# EAGLE design SPI_ESP12E (EAGLE 9.2.2)

## Sheet 1 of 2
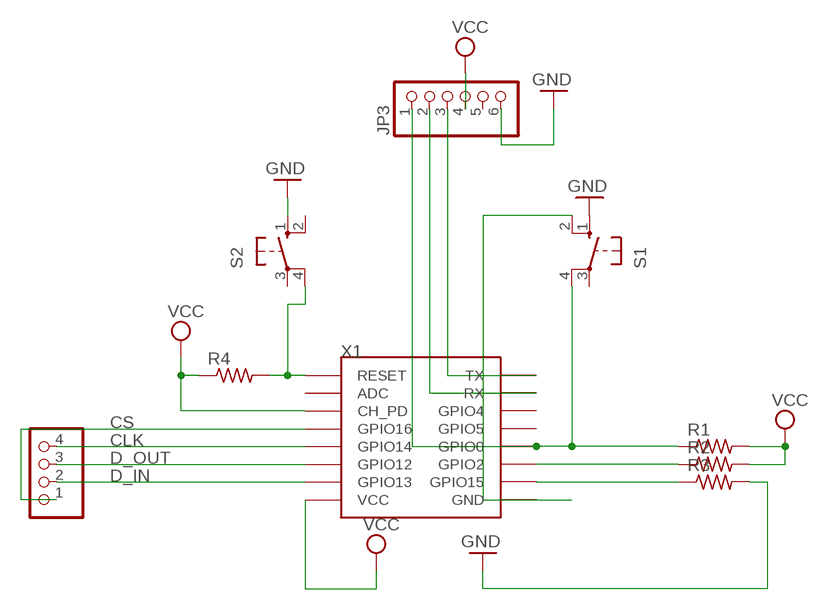
[diagram p0: schematic, sheet 1]

### Parts
JP3  PINHD-1X6B  [1X06-BIG]
R1  R-US_0204/7  [0204/7]
R2  R-US_0204/7  [0204/7]
R3  R-US_0204/7  [0204/7]
R4  R-US_0204/5  [0204/5]
S1  10-XX  [B3F-10XX]
S2  10-XX  [B3F-10XX]
SPI  PINHD-1X4  [1X04]
X1  ESP12SMD  [ESP12-SMD]

### Nets
CLK: SPI.4 X1.GPIO14
CS: SPI.1 X1.GPIO16
D_IN: SPI.2 X1.GPIO13
D_OUT: SPI.3 X1.GPIO12
GND: JP3.6 R3.2 S1.1(S) S2.1(S)
N$1: R3.1 X1.GPIO15
N$2: S1.2(S1) X1.GND
N$3: R2.1 X1.GPIO2
N$8: R4.2 S2.4(P1) X1.RESET
N$10: JP3.1 R1.1 S1.4(P1) X1.GPIO0
N$11: JP3.3 X1.TXD0(TX)
N$13: JP3.2 X1.RXD0(RX)
VCC: JP3.4 R1.2 R2.2 R4.1 X1.CH_PD X1.VCC
Unconnected: JP3.5 S1.3(P) S2.2(S1) S2.3(P) X1.ADC X1.GPIO4 X1.GPIO5

## Sheet 2 of 2

## Library data of the parts
JP3 = adafruit:PINHD-1X6: PIN HEADER
R1-R4 = resistor:R-US_: RESISTOR, American symbol
S1 S2 = switch-omron:10-XX: OMRON SWITCH; MPN: B3F-1000; OC_FARNELL: 176432; OC_NEWARK: 36M3542
SPI = pinhead:PINHD-1X4: PIN HEADER
X1 = esp8266modules:ESP12: ESP8266 Wifi module 12

## Net classes
0 default: width 0.254 mm, clearance 0.254 mm

## Board
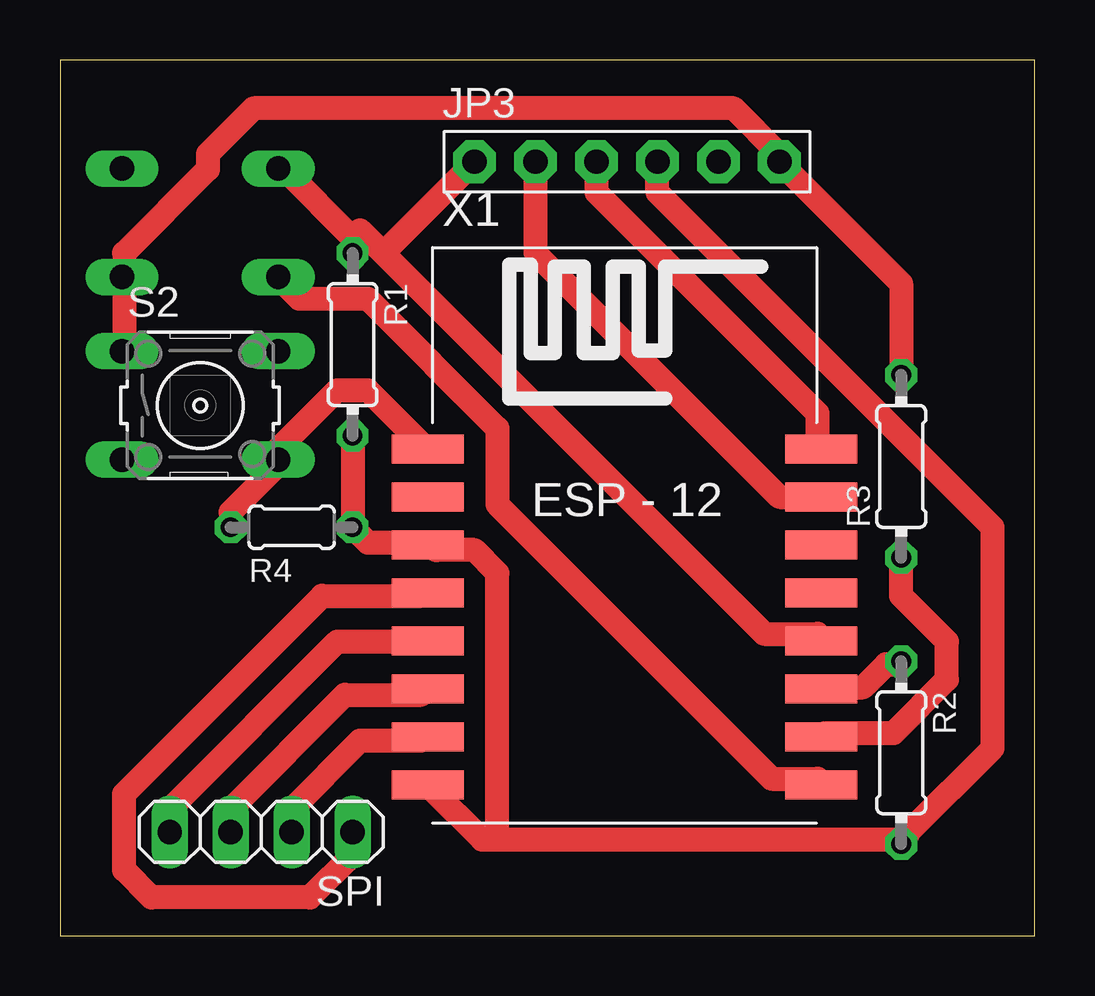
[diagram p1: board, top side]
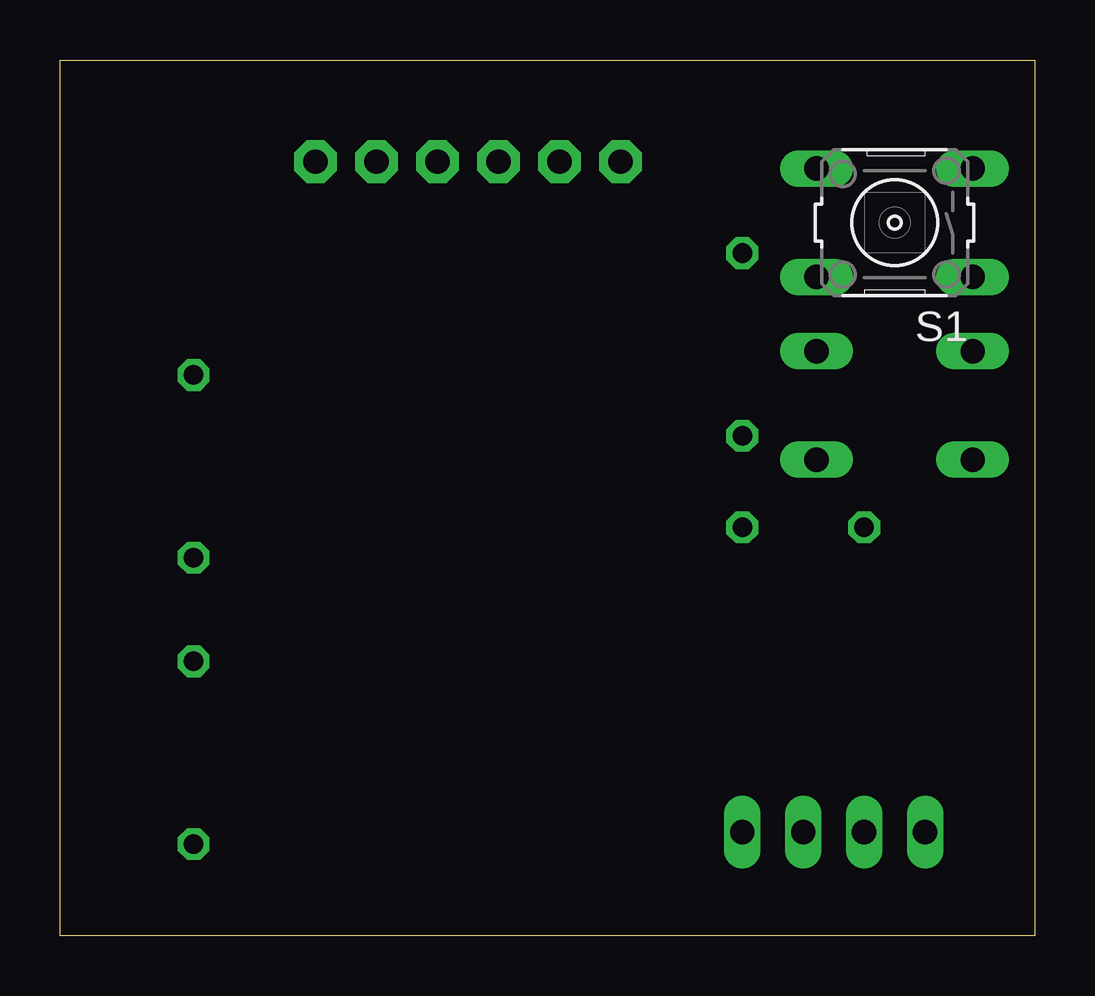
[diagram p2: board, bottom side, seen from below]

Size 40.62 x 36.5 mm. Coordinates in mm from the lower left corner, seen from the top.
Outline: 0,0 40.62,0 40.62,36.5 0,36.5 0,0
Copper layers (1*16): Top 0.035mm / dielectric 1.5mm / Bottom 0.035mm
Design rules "default *": minimum track width 1mm, minimum drill 0.35mm, track to track 0.6mm, track to pad 0.6mm, pad to pad 0.6mm, via to via 0.6mm, smd to smd 15mil, copper to edge 40mil, drill to drill 6mil, minimum pad ring 10mil, minimum via ring 8mil, stop-mask expansion 4mil, vias tented up to drill 0mil, thermal gap 10mil

### Footprints (pad centres in the part's own frame; a part is rotated, then mirrored left to right if it is on the bottom)
1X06-BIG = drill 1.016 pad 1.778 octagon: 1 -6.35,0; 2 -3.81,0; 3 -1.27,0; 4 1.27,0; 5 3.81,0; 6 6.35,0
0204/7 = drill 0.813 octagon: 1 -3.81,0; 2 3.81,0
0204/5 = drill 0.813 octagon: 1 -2.54,0; 2 2.54,0
B3F-10XX = drill 1.016 long: 1 -3.251,2.261; 2 3.251,2.261; 3 -3.251,-2.261; 4 3.251,-2.261
1X04 = drill 1.016 long: 1 -3.81,0; 2 -1.27,0; 3 1.27,0; 4 3.81,0
ESP12-SMD = smd 3 x 1.2: ADC -8.3,3.8; CH_PD -8.3,1.8; GND 8.1,-8.2; GPIO0 8.1,-2.2; GPIO2 8.1,-4.2; GPIO4 8.1,1.8; GPIO5 8.1,-0.2; GPIO12 -8.3,-4.2; GPIO13 -8.3,-6.2; GPIO14 -8.3,-2.2; GPIO15 8.1,-6.2; GPIO16 -8.3,-0.2; RESET -8.3,5.8; RXD0 8.1,3.8; TXD0 8.1,5.8; VCC -8.3,-8.2

### Placement (x,y rotation side)
JP3  23.62,32.26 0 top
R1  12.19,24.64 270 top
R2  35.05,7.62 270 top
R3  35.05,19.56 90 top
R4  9.65,17.02 180 top
S1  5.84,29.72 180 bottom
S2  5.84,22.1 0 top
SPI  8.38,4.32 180 top
X1  23.62,14.48 0 top

### Tracks (layer width: path | path; a pad name or v marks a point on that pad's centre or on a via)
CLK
  Top 1: SPI.4 4.57,5.27 11.56,12.26 15.05,12.26 X1.GPIO14
CS
  Top 1: SPI.1 12.19,3.37 10.41,1.59 3.81,1.59 2.67,2.73 2.67,5.91 10.92,14.16 15.05,14.16 X1.GPIO16
D_IN
  Top 1: SPI.2 9.65,5.27 12.51,8.13 15.05,8.13 X1.GPIO13
D_OUT
  Top 1: SPI.3 7.11,5.27 11.87,10.03 15.05,10.03 X1.GPIO12
GND
  Top 1: S2.1 2.67,24.64 2.67,27.18 S1.1 2.67,27.81 2.67,28.45 6.16,31.94 6.16,32.58 8.06,34.48 28.07,34.48 29.97,32.58 JP3.6 35.05,27.18 R3.2
N$1
  Top 1: R3.1 35.05,14.16 36.96,12.26 36.96,10.67 34.73,8.45 31.88,8.45 X1.GPIO15
N$2
  Top 1: X1.GND 31.56,6.54 29.65,6.54 18.22,17.97 18.22,21.14 12.83,26.54 9.97,26.54 9.34,27.18 S1.2
N$3
  Top 1: R2.1 35.05,11.3 34.42,11.3 33.47,10.35 31.88,10.35 X1.GPIO2
N$8
  Top 1: R4.2 7.11,17.65 9.02,19.56 S2.4 9.02,20.19 11.56,22.73 12.83,22.73 15.05,20.51 X1.RESET
N$10
  Top 1: 12.19,29.08 R1.1 | 12.19,29.08 9.34,31.94 S1.4 | 13.46,28.45 12.51,29.4 12.19,29.08 | 13.46,28.45 29.34,12.57 31.56,12.57 X1.GPIO0 | 13.46,28.45 JP3.1
N$11
  Top 1: JP3.3 22.35,30.99 31.56,21.78 31.56,20.51 X1.TXD0
N$13
  Top 1: JP3.2 19.81,28.45 29.97,18.29 31.56,18.29 X1.RXD0
VCC
  Top 1: R1.2 R4.1 12.83,16.38 15.05,16.38 X1.CH_PD 15.68,16.07 17.27,16.07 18.22,15.11 18.22,4 | 18.22,4 17.59,4 15.37,6.22 X1.VCC | 18.22,4 35.05,4 R2.2 35.37,4.32 38.86,7.81 38.86,17.02 24.89,30.99 JP3.4